# Altium schematic sheet LOC_BUI.SchDoc
size A4; SheetNumber: 1; SheetTotal: 1
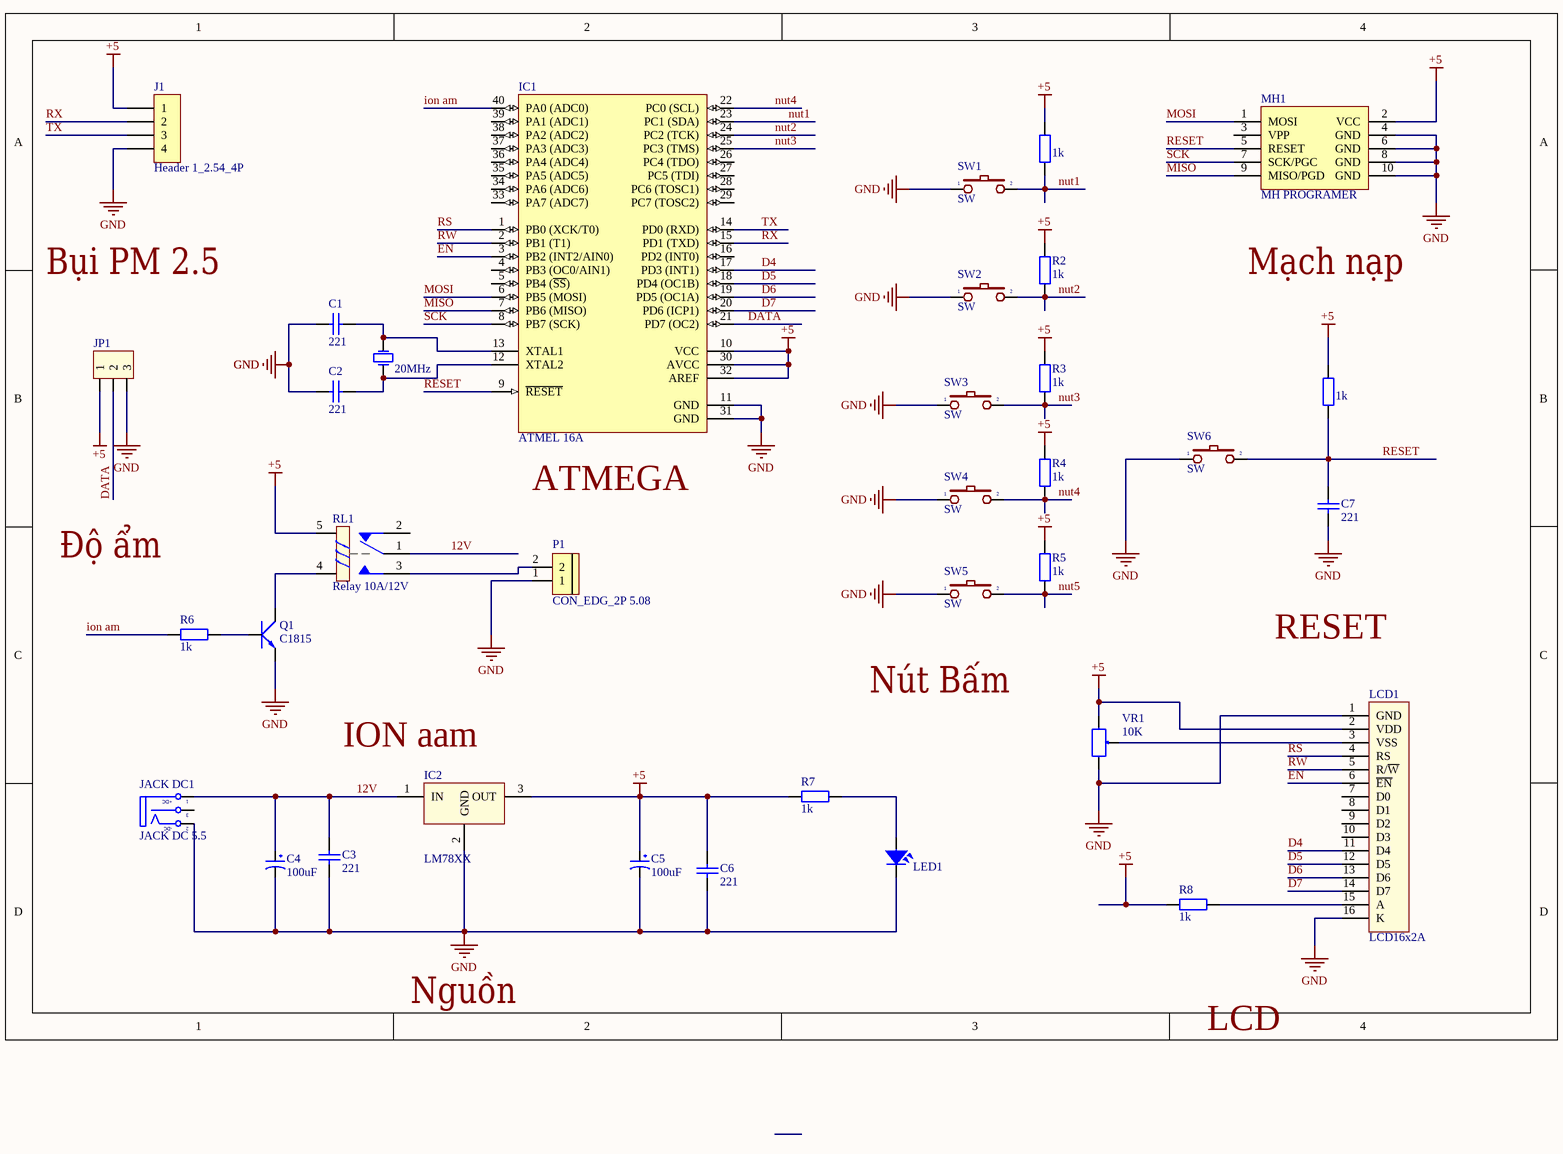
[diagram p0: LOC_BUI.SchDoc]

## Parts
C1  221  [tu 0805]
C2  221  [tu 0805]
C3  221  [tu 0805]
C4  100uF  [CP1/2.5]
C5  100uF  [CP1/2.5]
C6  221  [tu 0805]
C7  221  [tu 0805]
IC1  ATMEL 16A  [DIP40/W0.6]
IC2  LM78XX  [QTO-220]
J1  Header 1_2.54_4P  [Header_Duc Cong_4P 2.54]
JACK_DC1  JACK DC 5.5  [JACK DC 5.5]
JP1  (no value)  [XH2.54-3P]
LCD1  LCD16x2A  [LCD16X2]
LED1  LED  [LED-3]  (value not drawn)
MH1  MH PROGRAMER  [CABLE 10]
P1  CON_EDG_2P 5.08  [CON 2 2EDG5.08]
Q1  C1815  [QTO-92]
R1  1k  [tro smd 0805]
R2  1k  [tro smd 0805]
R3  1k  [tro smd 0805]
R4  1k  [tro smd 0805]
R5  1k  [tro smd 0805]
R6  1k  [tro smd 0805]
R7  1k  [tro smd 0805]
R8  1k  [tro smd 0805]
R9  1k  [tro smd 0805]
RL1  Relay 10A/12V  [RL_SPDT_10A]
SW1  SW  [SW2]
SW2  SW  [SW2]
SW3  SW  [SW2]
SW4  SW  [SW2]
SW5  SW  [SW2]
SW6  SW  [SW2]
VR1  10K  [VR]
x1  20MHz  [Thach anh cam]

## Nets
+5: C5.1 C6.1 IC1.10(VCC) IC1.30(AVCC) IC1.32(AREF) IC2.3(OUT) J1.1 JP1.1 LCD1.2(VDD) MH1.2(VCC) R1.2 R2.2 R3.2 R4.2 R5.2 R7.2 R8.2 R9.2 RL1.5 VR1.1
GND: C1.2 C2.2 C3.2 C4.2 C5.2 C6.2 C7.2 IC1.11(GND) IC1.31(GND) IC2.2(GND) J1.4 JACK_DC1.2(TN) JP1.3 LCD1.1(GND) LCD1.16(K) LED1.2 MH1.4(GND) MH1.6(GND) MH1.8(GND) MH1.10(GND) P1.1 Q1.1(E) SW1.1 SW2.1 SW3.1 SW4.1 SW5.1 SW6.1 VR1.3
12V: C3.1 C4.1 IC2.1(IN) JACK_DC1.1(T) RL1.1
D4: IC1.17(PD3_(INT1)) LCD1.11(D4)
D5: IC1.18(PD4_(OC1B)) LCD1.12(D5)
D6: IC1.19(PD5_(OC1A)) LCD1.13(D6)
D7: IC1.20(PD6_(ICP1)) LCD1.14(D7)
DATA: IC1.21(PD7_(OC2)) JP1.2
EN: IC1.3(PB2_(INT2/AIN0)) LCD1.6(~{EN})
ion am: IC1.40(PA0_(ADC0)) R6.2
MISO: IC1.7(PB6_(MISO)) MH1.9(MISO/PGD)
MOSI: IC1.6(PB5_(MOSI)) MH1.1(MOSI)
nut1: IC1.23(PC1_(SDA)) R1.1 SW1.2
nut2: IC1.24(PC2_(TCK)) R2.1 SW2.2
nut3: IC1.25(PC3_(TMS)) R3.1 SW3.2
nut4: IC1.22(PC0_(SCL)) R4.1 SW4.2
nut5: R5.1 SW5.2
RESET: C7.1 IC1.9(~{RESET}) MH1.5(RESET) R9.1 SW6.2
RS: IC1.1(PB0_(XCK/T0)) LCD1.4(RS)
RW: IC1.2(PB1_(T1)) LCD1.5(R/~{W})
RX: IC1.15(PD1_(TXD)) J1.2
SCK: IC1.8(PB7_(SCK)) MH1.7(SCK/PGC)
TX: IC1.14(PD0_(RXD)) J1.3
NetC1_1: C1.1 IC1.13(XTAL1) x1.1(OSC1)
NetC2_1: C2.1 IC1.12(XTAL2) x1.2(OSC2)
NetLCD1_3: LCD1.3(VSS) VR1.2
NetLCD1_15: LCD1.15(A) R8.1
NetLED1_1: LED1.1 R7.1
NetP1_2: P1.2 RL1.3
NetQ1_2: Q1.2(C) RL1.4
NetQ1_3: Q1.3(B) R6.1

Not connected (* = marked no-connect by the designer): IC1 4(PB3_(OC0/AIN1)) 5(PB4_(~{SS})) 16(PD2_(INT0)) 26(PC4_(TDO)) 27(PC5_(TDI)) 28(PC6_(TOSC1)) 29(PC7_(TOSC2)) 33(PA7_(ADC7)) 34(PA6_(ADC6)) 35(PA5_(ADC5)) 36(PA4_(ADC4)) 37(PA3_(ADC3)) 38(PA2_(ADC2)) 39(PA1_(ADC1)); JACK_DC1 3(S); LCD1 7(D0) 8(D1) 9(D2) 10(D3); MH1 3(VPP); RL1 2

## Notes on the sheet
- Labels drawn without touching a wire or pin: ATMEGA, ION aam, LCD, Mạch nạp, Nguồn, Nút Bấm, RESET, Độ ẩm
- (in symbol JACK DC 5.5) +DC; -DC

## Library data of the parts
C1-C3 C6 C7 = Tu 0805 221 50V: Dán; Don_Vi: Con; So_Chan: 2; Ten_Linh_Kien: Tụ 0805 221-220P 50V; Ma_Hang: MH007365; Chung_Loai: Dán; Kieu_Chan: *
C4 C5 = CP2: C 47uF/50V , 220uF/16V; Value: 47uF/16 - 50V; Description 1: 470uF/6,3V - 330uF/10V - 220uF/16V; Description 2: 100uF/25V - 35V - 47uF/50V - 22uF/100V; Description 3: 33uF => 47uF/63V - 1uF => 4,7uF/160V; Description 4: 1uF => 2,2uF/250V - 1uF/350V
IC1 = ATmega16A-PU: 8-Bit AVR Microcontroller with 16K Bytes of In-System Programmable Flash Memory; Value: Atmega 16L
IC2 = LM78XX: On ap +, from + 5 to + 24VDC; Value: LM7805
J1 = Header 1_2.54_4P: Cắm; Chung_Loai: Cắm
JACK_DC1 = JACK DC 5.5: Value: Jac DC
JP1 = Header 3P Duc Thang: Connector 3; Value: Connector 3
LCD1 = LCD16X2: JUMP DON CAI; Value: LCD16x2A
LED1 = LED: LED Single colour Green and Red; Value: LED 3 ly Single Colour
MH1 = MH PRO
P1 = CON_EDG_2P 5.08: Cắm; Ten_Linh_Kien: CON 2 2EDG5.08-2P 5.08MM ( Xanh Cong); Don_Vi: Con; Ma_Hang: MH000759; Ghi_Chu: *; Kieu_Chan: *; Chung_Loai: Cắm
Q1 = C1815_1: NPN 600mW, ECB; Value: C1815
R1 R9 = Tro 0805 1% 1k: Dán; Don_Vi: Con; So_Chan: 2; Ten_Linh_Kien: Trở 0805 1% 1k; Ma_Hang: MH005468; Chung_Loai: Dán; Kieu_Chan: *
R2-R8 = Tro 0805 5% 1k: Dán; Don_Vi: Con; So_Chan: 2; Ten_Linh_Kien: Trở 0805 5% 1k; Ma_Hang: MH005234; Chung_Loai: Dán; Kieu_Chan: *
RL1 = Relay 1: Relay SPDT,10A - 12VDC 5 Pin; Value: Relay SPDT, 10A, 12V
SW1-SW6 = SW2: Switch button 2 pin; Value: SW chip 2 pin
VR1 = VR: Var Resistor; Value: VR 10K
x1 = Crystal: Crystal Oscillator; Published: 8-Jun-2000; LatestRevisionDate: 17-Jul-2002; LatestRevisionNote: Re-released for DXP Platform.; PackageReference: R38; Publisher: Altium Limited